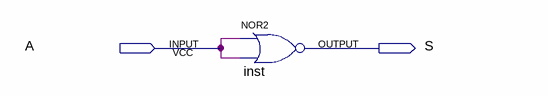
[diagram p0: schematic sheet]
// Quartus schematic nor_not.bdf as structural Verilog: 1 symbols, 2 pins
module nor_not (
  input  A,
  output S
);

  nor inst (S, A, A);
endmodule
